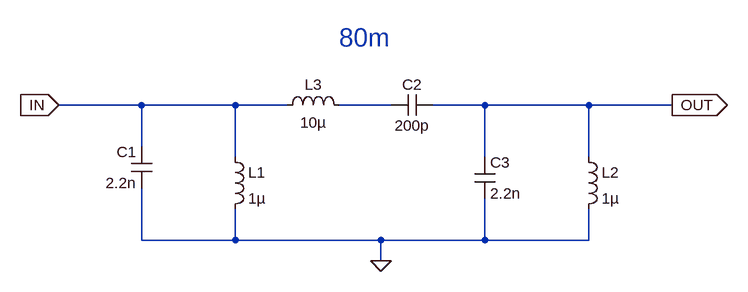
[diagram p0: schematic 80m BP.asc]
80m BP.asc, the LTspice schematic file:
Version 4
SHEET 1 1436 712
WIRE 464 -144 336 -144
WIRE 608 -144 464 -144
WIRE 688 -144 608 -144
WIRE 848 -144 768 -144
WIRE 992 -144 912 -144
WIRE 1152 -144 992 -144
WIRE 1280 -144 1152 -144
WIRE 464 -80 464 -144
WIRE 608 -64 608 -144
WIRE 992 -64 992 -144
WIRE 1152 -64 1152 -144
WIRE 464 64 464 -16
WIRE 608 64 608 16
WIRE 608 64 464 64
WIRE 832 64 608 64
WIRE 992 64 992 0
WIRE 992 64 832 64
WIRE 1152 64 1152 16
WIRE 1152 64 992 64
WIRE 832 96 832 64
FLAG 336 -144 IN
IOPIN 336 -144 In
FLAG 1280 -144 OUT
IOPIN 1280 -144 Out
FLAG 832 96 0
SYMBOL cap 480 -16 R180
WINDOW 0 24 56 Left 2
WINDOW 3 24 8 Left 2
SYMATTR InstName C1
SYMATTR Value 2.2n
SYMBOL cap 912 -160 R90
WINDOW 0 0 32 VBottom 2
WINDOW 3 32 32 VTop 2
SYMATTR InstName C2
SYMATTR Value 200p
SYMBOL ind 592 -80 R0
SYMATTR InstName L1
SYMATTR Value 1µ
SYMBOL ind 1136 -80 R0
SYMATTR InstName L2
SYMATTR Value 1µ
SYMBOL cap 976 -64 R0
SYMATTR InstName C3
SYMATTR Value 2.2n
SYMBOL ind 672 -128 R270
WINDOW 0 32 56 VTop 2
WINDOW 3 5 56 VBottom 2
SYMATTR InstName L3
SYMATTR Value 10µ
TEXT 768 -248 Left 4 ;80m

The netlist it stands for:
* 80m BP.asc
C1 0 IN 2.2n
C2 OUT N001 200p
L1 IN 0 1µ
L2 OUT 0 1µ
C3 OUT 0 2.2n
L3 IN N001 10µ
* 80m
.backanno
.end